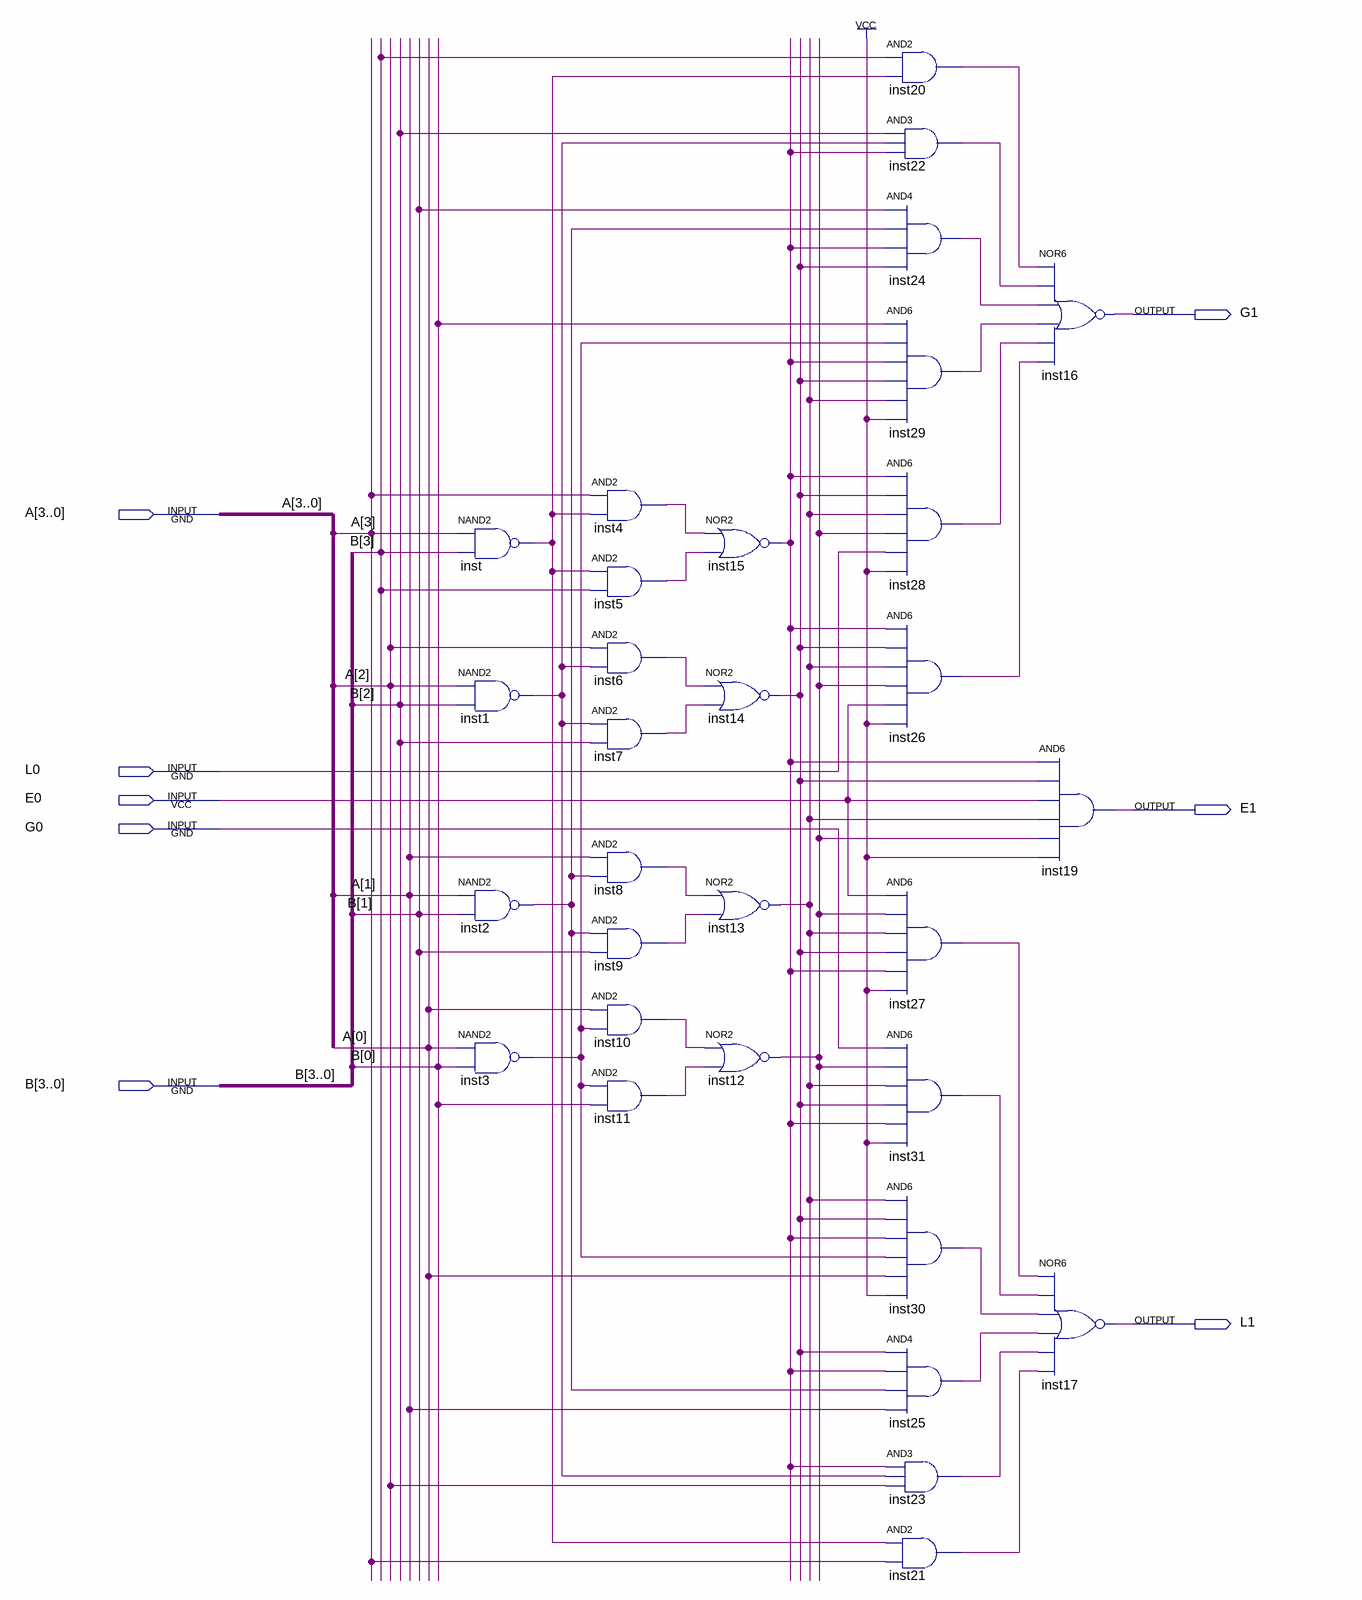
[diagram p0: schematic sheet]
// Quartus schematic cmp4.bdf as structural Verilog: 31 symbols, 8 pins
module cmp4 (
  input  [3:0] A,
  input  L0,
  input  E0,
  input  G0,
  input  [3:0] B,
  output G1,
  output E1,
  output L1
);

  wire inst1_out, inst2_out, inst3_out, inst4_out, inst5_out, inst6_out, inst7_out, inst8_out, inst9_out,
       inst10_out, inst11_out, inst12_out, inst13_out, inst14_out, inst15_out, inst20_out, inst21_out,
       inst22_out, inst23_out, inst24_out, inst25_out, inst26_out, inst27_out, inst28_out, inst29_out,
       inst30_out, inst31_out, inst_out;

  nand inst (inst_out, A[3], B[3]);
  nand inst1 (inst1_out, A[2], B[2]);
  nand inst2 (inst2_out, A[1], B[1]);
  nand inst3 (inst3_out, A[0], B[0]);
  and inst4 (inst4_out, A[3], inst_out);
  and inst5 (inst5_out, inst_out, B[3]);
  and inst6 (inst6_out, A[2], inst1_out);
  and inst7 (inst7_out, inst1_out, B[2]);
  and inst8 (inst8_out, A[1], inst2_out);
  and inst9 (inst9_out, inst2_out, B[1]);
  and inst10 (inst10_out, A[0], inst3_out);
  and inst11 (inst11_out, inst3_out, B[0]);
  nor inst15 (inst15_out, inst4_out, inst5_out);
  nor inst14 (inst14_out, inst6_out, inst7_out);
  nor inst13 (inst13_out, inst8_out, inst9_out);
  nor inst12 (inst12_out, inst10_out, inst11_out);
  and inst20 (inst20_out, B[3], inst_out);
  and inst22 (inst22_out, B[2], inst1_out, inst15_out);
  and inst24 (inst24_out, B[1], inst2_out, inst15_out, inst14_out);
  and inst29 (inst29_out, B[0], inst3_out, inst15_out, inst14_out, inst13_out, 1'b1);
  and inst28 (inst28_out, inst15_out, inst14_out, inst13_out, inst12_out, L0, 1'b1);
  and inst26 (inst26_out, inst15_out, inst14_out, inst13_out, inst12_out, E0, 1'b1);
  and inst27 (inst27_out, E0, inst12_out, inst13_out, inst14_out, inst15_out, 1'b1);
  and inst31 (inst31_out, G0, inst12_out, inst13_out, inst14_out, inst15_out, 1'b1);
  and inst30 (inst30_out, inst13_out, inst14_out, inst15_out, inst3_out, A[0], 1'b1);
  and inst25 (inst25_out, inst14_out, inst15_out, inst2_out, A[1]);
  and inst23 (inst23_out, inst15_out, inst1_out, A[2]);
  and inst21 (inst21_out, inst_out, A[3]);
  nor inst16 (G1, inst20_out, inst22_out, inst24_out, inst29_out, inst28_out, inst26_out);
  and inst19 (E1, inst15_out, inst14_out, E0, inst13_out, inst12_out, 1'b1);
  nor inst17 (L1, inst27_out, inst31_out, inst30_out, inst25_out, inst23_out, inst21_out);
endmodule
